# Altium project Adafruit nRF52840 Bluefruit Feather Express Rev D.PrjPcb
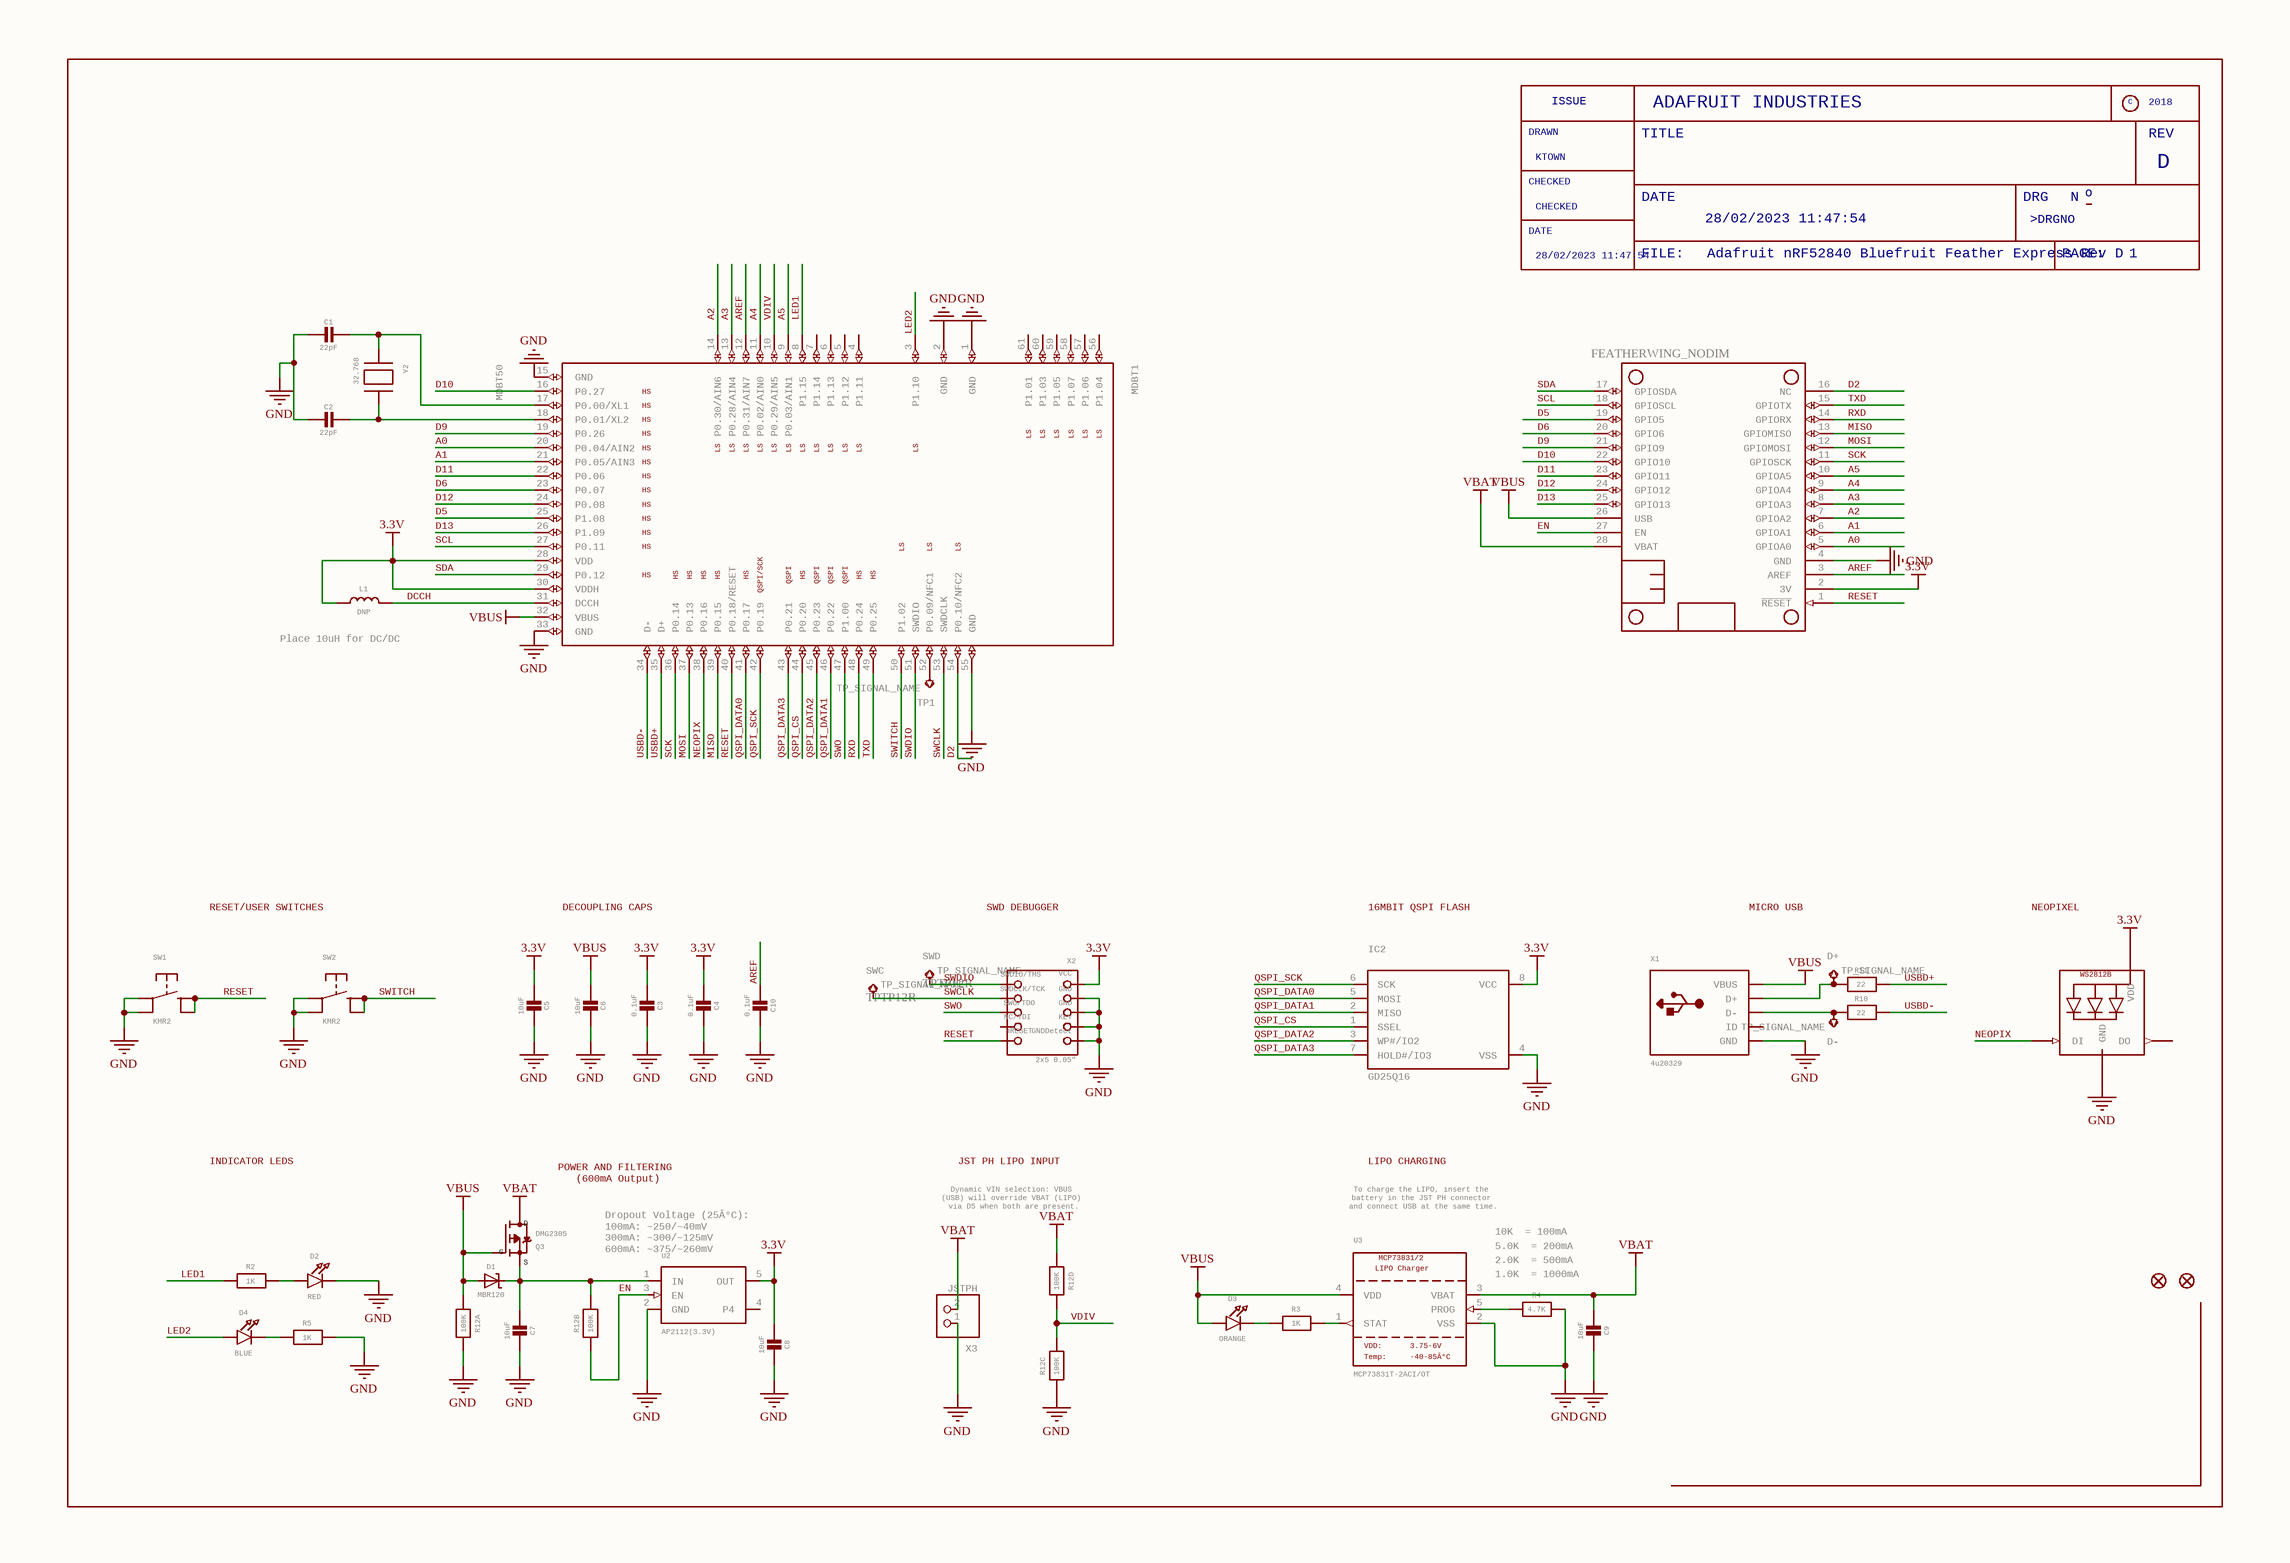
[diagram p0: Adafruit nRF52840 Bluefruit Feather Express Rev D_1.SchDoc]
1 sheet, 42 parts. Net scope: global (net labels, ports and power ports of the same name join across sheets).
Board file: Adafruit nRF52840 Bluefruit Feather Express Rev D.PcbDoc

## Sheet Adafruit nRF52840 Bluefruit Feather Express Rev D_1.SchDoc: Adafruit nRF52840 Bluefruit Feather Express Rev D
size 409 x 279 mm; Origin: Eagle; SheetNumber: 1; YEAR: 2018; COMPANY: ADAFRUIT INDUSTRIES; DRAWN: KTOWN; Date: 28/02/2023 11:47:54; REV: D; GateName_1: G$1; SymbolName_1: FRAME_A3; LibraryName: microbuilder; DeviceSetName: FRAME_A3; GateName_2: G$3; SymbolName_2: FRAME_DOCFIELD; DRG: DRG; o: o; N: N; C: C; ISSUE: ISSUE; FILE: FILE:; PAGE: PAGE:; CHECKED: CHECKED; DRGNO: >DRGNO

### Parts
C1  22pF  [0603-NO]
C2  22pF  [0603-NO]
C3  0.1uF  [0603-NO]
C4  0.1uF  [0603-NO]
C5  10uF  [0805-NO]
C6  10uF  [0805-NO]
C7  10uF  [0805-NO]
C8  10uF  [0805-NO]
C9  10uF  [0805-NO]
C10  0.1uF  [0603-NO]
D1  MBR120  [SOD-123]
D2  RED  [CHIPLED_0805_NOOUTLINE]
D3  ORANGE  [CHIPLED_0805_NOOUTLINE]
D4  BLUE  [CHIPLED_0805_NOOUTLINE]
D+  TPTP10R  [TP10R]  (value not drawn)
D-  TPTP10R  [TP10R]  (value not drawn)
FID1  FIDUCIAL_1MM  [FIDUCIAL_1MM]  (value not drawn)
FID2  FIDUCIAL_1MM  [FIDUCIAL_1MM]  (value not drawn)
IC2  GD25Q16  [USON8]
L1  DNP  [_0805MP]
LED1  WS2812B3535  [LED3535]  (value not drawn)
MDBT1  MDBT50  [MDBT50]
MS1  FEATHERWING_NODIM  [FEATHERWING_NODIM]
Q3  DMG2305  [SOT23-R]
R2  1K  [0603-NO]
R3  1K  [0603-NO]
R4  4.7K  [0603-NO]
R5  1K  [0603-NO]
R10  22  [0603-NO]
R11  22  [0603-NO]
R12  100K  [RESPACK_4X0603]  (parts A,B,C,D of 4)
SW1  KMR2  [BTN_KMR2_4.6X2.8]
SW2  KMR2  [BTN_KMR2_4.6X2.8]
SWC  TPTP12R  [TP12R]
SWD  TPTP12R  [TP12R]
TP1  TPTP10R  [TP10R]  (value not drawn)
U2  AP2112(3.3V)  [SOT23-5]
U3  MCP73831T-2ACI/OT  LIPOCharger: LIPO Charger  Temp: Temp:  VDD: VDD:  [SOT23-5]
X1  4u20329  [4UCONN_20329_V2]
X2  2x5 0.05"  [2X05_1.27MM_BOX_POSTS]
X3  JSTPH  [JSTPH2]
Y2  32.768  [XTAL3215]

### Nets
3.3V: C3.2 C4.2 C5.2 C8.2 IC2.8(VCC) L1.1 LED1.2(VDD) MDBT1.28(VDD) MDBT1.30(VDDH) MS1.2(3V) U2.5(OUT) X2.1(VCC)
GND: C1.2 C2.2 C3.1 C4.1 C5.1 C6.1 C7.1 C8.1 C9.1 C10.1 D2.C IC2.4(VSS) LED1.4(GND) MDBT1.1(GND) MDBT1.2(GND) MDBT1.15(GND) MDBT1.33(GND) MDBT1.55(GND) MS1.4(GND) R4.2 R5.2 R12.3 R12.8 SW1.A(P) SW1.A'(P1) SW2.A(P) SW2.A'(P1) U2.2(GND) U3.2(VSS) X1.BASE@1,BASE@2,GND,SPRT@1,SPRT@2,SPRT@3,SPRT@4(GND) X2.3(GND) X2.5(GND) X2.7(KEY) X2.9(GNDDETECT) X3.1
VBAT: C9.2 MS1.28(VBAT) Q3.3(D) R12.4 U3.3(VBAT) X3.2
VBUS: C6.2 D1.A D3.A MDBT1.32(VBUS) MS1.26(USB) Q3.1(G) R12.1 U3.4(VDD) X1.VBUS
A0: MDBT1.20(P0.04/AIN2) MS1.5(GPIOA0)
A1: MDBT1.21(P0.05/AIN3) MS1.6(GPIOA1)
A2: MDBT1.14(P0.30/AIN6) MS1.7(GPIOA2)
A3: MDBT1.13(P0.28/AIN4) MS1.8(GPIOA3)
A4: MDBT1.11(P0.02/AIN0) MS1.9(GPIOA4)
A5: MDBT1.9(P0.03/AIN1) MS1.10(GPIOA5)
AREF: C10.2 MDBT1.12(P0.31/AIN7) MS1.3(AREF)
D2: MDBT1.54(P0.10/NFC2) MS1.16(NC)
D5: MDBT1.25(P1.08) MS1.19(GPIO5)
D6: MDBT1.23(P0.07) MS1.20(GPIO6)
D9: MDBT1.19(P0.26) MS1.21(GPIO9)
D10: MDBT1.16(P0.27) MS1.22(GPIO10)
D11: MDBT1.22(P0.06) MS1.23(GPIO11)
D12: MDBT1.24(P0.08) MS1.24(GPIO12)
D13: MDBT1.26(P1.09) MS1.25(GPIO13)
DCCH: L1.2 MDBT1.31(DCCH)
EN: MS1.27(EN) R12.2 U2.3(EN)
LED1: MDBT1.8(P1.15) R2.1
LED2: D4.A MDBT1.3(P1.10)
MISO: MDBT1.39(P0.15) MS1.13(GPIOMISO)
MOSI: MDBT1.37(P0.13) MS1.12(GPIOMOSI)
NEOPIX: LED1.1(DI) MDBT1.38(P0.16)
QSPI_CS: IC2.1(SSEL) MDBT1.44(P0.20)
QSPI_DATA0: IC2.5(MOSI) MDBT1.41(P0.17)
QSPI_DATA1: IC2.2(MISO) MDBT1.46(P0.22)
QSPI_DATA2: IC2.3(WP#/IO2) MDBT1.45(P0.23)
QSPI_DATA3: IC2.7(HOLD#/IO3) MDBT1.43(P0.21)
QSPI_SCK: IC2.6(SCK) MDBT1.42(P0.19)
RESET: MDBT1.40(P0.18/RESET) MS1.1(~{RESET}) SW1.B(S) SW1.B'(S1) X2.10(NRESET)
RXD: MDBT1.48(P0.24) MS1.14(GPIORX)
SCK: MDBT1.36(P0.14) MS1.11(GPIOSCK)
SCL: MDBT1.27(P0.11) MS1.18(GPIOSCL)
SDA: MDBT1.29(P0.12) MS1.17(GPIOSDA)
SWCLK: MDBT1.53(SWDCLK) SWC.TP X2.4(SWDCLK)
SWDIO: MDBT1.51(SWDIO) SWD.TP X2.2(SWDIO)
SWITCH: MDBT1.50(P1.02) SW2.B(S) SW2.B'(S1)
SWO: MDBT1.47(P1.00) X2.6(SWO)
TXD: MDBT1.49(P0.25) MS1.15(GPIOTX)
USBD+: MDBT1.35(D+) R11.2
USBD-: MDBT1.34(D-) R10.2
VDIV: MDBT1.10(P0.29/AIN5) R12.5 R12.6
NetC1_1: C1.1 MDBT1.17(P0.00/XL1) Y2.P$1
NetC2_1: C2.1 MDBT1.18(P0.01/XL2) Y2.P$2
NetC7_2: C7.2 D1.C Q3.2(S) R12.7 U2.1(IN)
NetD2_A: D2.A R2.2
NetD3_C: D3.C R3.1
NetD4_C: D4.C R5.1
NetD+_TP: D+.TP R11.1 X1.D+
NetD-_TP: D-.TP R10.1 X1.D-
NetMDBT1_52: MDBT1.52(P0.09/NFC1) TP1.TP
NetR3_2: R3.2 U3.1(STAT)
NetR4_1: R4.1 U3.5(PROG)

Not connected (* = marked no-connect by the designer): LED1 3(DO); MDBT1 4(P1.11) 5(P1.12) 6(P1.13) 7(P1.14) 56(P1.04) 57(P1.06) 58(P1.07) 59(P1.05) 60(P1.03) 61(P1.01); U2 4(P4); X1 ID; X2 8(TDI)

### Notes on the sheet
- ISSUE
- C
- 2018
- DRAWN
- KTOWN
- TITLE
- ADAFRUIT INDUSTRIES
- REV
- D
- CHECKED
- DATE
- 28/02/2023 11:47:54
- DRG
- >DRGNO
- N
- o
- FILE:
- Adafruit nRF52840 Bluefruit Feather Express Rev D
- PAGE:
- 1
- (near L1) Place 10uH for DC/DC
- RESET/USER SWITCHES
- DECOUPLING CAPS
- SWD DEBUGGER
- 16MBIT QSPI FLASH
- MICRO USB
- NEOPIXEL
- INDICATOR LEDS
- JST PH LIPO INPUT
- LIPO CHARGING
- (near Q3) POWER AND FILTERING
  (600mA Output)
- Dynamic VIN selection: VBUS
  (USB) will override VBAT (LIPO)
  via D5 when both are present.
- To charge the LIPO, insert the
  battery in the JST PH connector
  and connect USB at the same time.
- 10K  = 100mA
- (near U2) Dropout Voltage (25Â°C):
  100mA: ~250/~40mV
  300mA: ~300/~125mV
  600mA: ~375/~260mV
- 5.0K  = 200mA
- 2.0K  = 500mA
- 1.0K  = 1000mA

### Library data of the parts
C1-C4 C10 = CAP_CERAMIC0603_NO: Ceramic Capacitors   For new designs, use the packages preceded by an '_' character since they are more reliable:   The following footprints should be used on most boards: _0402 - Standard footprint for regular board layouts  _0603 - Standard footprint for regular board layouts  _0805 - Standard footprint for regular board layouts  _1206 - Standard footprint for regular board layouts       For extremely tight-pitch boards where space is at a premium, the following 'micro-pitch' footprints can be used (smaller pads, no silkscreen outline, etc.): _0402MP - Micro-pitch footprint for very dense/compact boards  _0603MP - Micro-pitch footprint for very dense/compact boards  _0805MP - Micro-pitch footprint for very dense/compact boards  _1206MP - Micro-pitch footprint for very dense/compact boards; GateName_1: G$1; SymbolName_1: CAPACITOR; DeviceName: 0603_NO; LibraryName: microbuilder; DeviceSetName: CAP_CERAMIC
C5-C9 = CAP_CERAMIC0805-NOOUTLINE: Ceramic Capacitors   For new designs, use the packages preceded by an '_' character since they are more reliable:   The following footprints should be used on most boards: _0402 - Standard footprint for regular board layouts  _0603 - Standard footprint for regular board layouts  _0805 - Standard footprint for regular board layouts  _1206 - Standard footprint for regular board layouts       For extremely tight-pitch boards where space is at a premium, the following 'micro-pitch' footprints can be used (smaller pads, no silkscreen outline, etc.): _0402MP - Micro-pitch footprint for very dense/compact boards  _0603MP - Micro-pitch footprint for very dense/compact boards  _0805MP - Micro-pitch footprint for very dense/compact boards  _1206MP - Micro-pitch footprint for very dense/compact boards; GateName_1: G$1; SymbolName_1: CAPACITOR; DeviceName: 0805-NOOUTLINE; LibraryName: microbuilder; DeviceSetName: CAP_CERAMIC
D1 = DIODE-SCHOTTKYSOD-123: GateName_1: G$1; SymbolName_1: DIODE-SCHOTTKY; DeviceName: SOD-123; LibraryName: microbuilder; DeviceSetName: DIODE-SCHOTTKY
D2-D4 = LED0805_NOOUTLINE: LED0603 - 0603 Surface Mount Package    2mA: Green LED - Low Power (3.9mcd, 2ma, 1.7Vf) - Digikey: 475-2709-2-ND  Orange LED - Low Power (9.8mcd, 2ma, 1.8Vf) - Digikey: 475-1194-2-ND  Red LED - Low Power (5mcd, 2ma, 1.8Vf) - Digikey: 475-1195-2-ND  Yellow LED - Low Power (7mcd, 2ma, 1.8Vf) - Digikey: 475-1196-2-ND       5mA: Blue LED - Low Power (17mcd, 5ma, 2.9Vf) - Digikey: LNJ937W8CRACT-ND    0805 - 0805 Surface Mount Package    2mA: Red LED (8.8mcd, 2mA, 1.8Vf, Clear) - Low Power [Digikey: 475-2510-1-ND]  Green LED (5mcd, 2mA, 1.8Vf, Clear) - Low Power [Digikey: 475-2730-1-ND]  Yellow LED (11.3mcd, 2mA, 1.8Vf, Clear) - Low Power [Digikey: 475-2555-1-ND]       20mA: Red LED (104mcd, 20mA, Diffused) - LS R976 [Digikey: 475-1278-6-ND]  Red LED (12mcd, 20mA, 2.0Vf, Clear) - APT2012EC [Digikey: 754-1128-1-ND]  Green LED (15mcd, 20mA, 2.2Vf, Clear) - APT2012GC [Digikey: 754-1131-1-ND]  Orange LED (160mcd, 20mA, 2.1Vf, Clear) - APT2012SECK [Digikey: 754-1130-1-ND]     1206 - 1206 Surface Mount Package  Green LED (26mcd, 20mA, Diffused) - LG N971  [Digikey: 475-1407-6-ND]  Red LED (15mcd, 20mA, Diffused) - LH N974 [Digikey: 475-1416-6-ND]     Cree - Cree High-Power Surface Mount LEDs  XPEBWT-L1-0000-00D50 - White 111lm 350mA 2.9Vf 6200K 110Â°  XTEAWT-00-0000-00000LEE3 - White 114lm 350mA 2.85Vf 5000K 115Â°     Everlight - Everlight 45-21 Series Surface Mount LEDs  45-21/QK2C-B2832AC2CB2/2T - Warm White 2000mcd 20mA 3.25Vf 3050K 120Â°  45-21/LK2C-B38452C4CB2/2T - Nuetral White 2000mcd 20mA 3.25Vf 4150K 120Â°  45-21/LK2C-B50634C6CB2/2T - Cold White 2200mcd 20mA 3.25Vf 5650K 120Â°     PLCC2 Reverse Mount LS T77K-J1L2-1-0-2-R18-Z - Red 11.25mcd 2mA 1.8Vf 630nm 120Â°  LO T77K-L1M2-24-Z - Orange 19.6mcd 2mA 1.8Vf 606nm 120Â°  LY T77K-K2M1-26-Z - Yellow 15.7mcd 2mA 1.8Vf 587nm 120Â°; GateName_1: G$1; SymbolName_1: LED; DeviceName: 0805_NOOUTLINE; LibraryName: microbuilder; DeviceSetName: LED
D+ D- TP1 = TPTP10R: Test pad; GateName_1: G$1; SymbolName_1: TP; DeviceName: TP10R; LibraryName: testpad; DeviceSetName: TP; TP_SIGNAL_NAME: TP_SIGNAL_NAME
FID1 FID2 = FIDUCIAL_1MM: Fiducial Alignment Points   Various fiducial points for machine vision alignment.; GateName_1: G$1; DeviceName: _1MM; BOM: EXCLUDE; SymbolName_1: FIDUCIAL; LibraryName: microbuilder; DeviceSetName: FIDUCIAL
IC2 = SPIFLASH_8PINUX: SOIC8 SPI Flash   Be careful with the size since SOIC8 flash comes in several 'widths'   SOIC8 150 mil M25P16 - 16Mbit (2Mbit x 8) Serial Flash (75MHz SPI Bus), Supply: 2.7-3.6V  Digikey:  SOIC8 - M25P16-VMN6P-ND       SOIC8 208 mil W25Q16BVSSIG - 16Mbit (2Mbit x 8) Serial Flash (104MHz SPI Bus), Supply: 2.7-3.6V  Digikey:  SOIC8 - W25Q16BVSSIG-ND; GateName_1: G$1; DeviceName: UX; SymbolName_1: M25P16; LibraryName: microbuilder; DeviceSetName: SPIFLASH_8PIN
L1 = INDUCTOR_0805MP: Inductors   0603: 10nH Ceramic Inductor - microwire antenna/RF (Digikey: 712-1434-2-ND)       0805: 560nH Ceramic Inductor - RF (Digikey: 553-1047-1-ND)  270nH Ceramic Inductor - Q = 40@250MHz, +-5%, 1 Ohm DC Resistance (Digikey: 535-10506-2-ND)       1007 (2518 Metric) SMT: 10ÂµH 10% 250mOhm 820mA 1007 Inductor (Digikey: 587-2189-1-ND)  22ÂµH 10% 500mOhm 580mA 1007 Inductor (Digikey: 587-2190-1-ND)  47ÂµH 10% 950mOhm 420mA 1007 Inductor (Digikey: 587-2191-1-ND)  47ÂµH 5% 100mOhm 1A 1008 Inductor (Digikey: 732-1816-1-ND)       5.0x5.0mm (Taiyo Yuden NR5040 Series) 6.8ÂµH 20% 2.3A 64mOhm Inductor (Digikey: 587-2374-2-ND)       5.0x5.0mm (TDK VLC5045 Series) 4.7ÂµH 20% 3.3A 34mOhm Inductor (Digikey: 445-6526-1-ND)  6.8ÂµH 20% 2.7A 46mOhm Inductor (Digikey: 445-6527-1-ND)       6.0x6.0mm (TDK VLC6045 Series) 4.7ÂµH 20% 3.8A 27mOhm Inductor (Digikey: 445-6538-2-ND)  6.8ÂµH 20% 3A 41mOhm Inductor (Digikey: 445-6540-1-ND)  6.2ÂµH 30% 2.2A 45mOhm Inductor (Digikey: SRR5028-6R2YCT-ND) - Not TDK VLC6045 but footprint should match       6.0x6.0mm (TDK SLF6045 Series) 6.8uH 30% 2A 33mOhm Inductor (Digikey: 445-4572-1-ND, Mouser: 810-SLF645T6R8N2R0PF)       6.0x6.0mm (Sumida CDRH5D28 Series) 6.2uH 30% 1.8A 45mOhm Inductor (Digikey: 308-1542-1-ND)       Taiyo Yuden NR3015T2R2M - 2.2uH 20% 1.5A (Digikey: 587-1648-2-ND, Mouser: 963-NR3015T2R2M) - Used with TI TPS62172   CoilCraft RFID Transponder Coil - MA5532-AE (For use with AS3935 Lightning Sensor)   Taiyo Yuden NRH2412T2R2MNGH - 2.2uH 20% 1AA (Digikey: 587-3443-1-ND) - Used with TI LM3671   Vishay IHLP  1.0uH Molded Inductor - 24mOhm DCR, 5A, +/-20%, -55Â°C-125Â°C (Digikey: 541-1319-1-ND); GateName_1: G$1; SymbolName_1: INDUCTOR; DeviceName: _0805MP; LibraryName: microbuilder; DeviceSetName: INDUCTOR
LED1 = WS2812B3535: GateName_1: G$1; SymbolName_1: WS2812BLED; DeviceName: 3535; LibraryName: microbuilder; DeviceSetName: WS2812B; WS2812B: WS2812B
MDBT1 = MDBT50: Raytac Corporation   MDBT50  Bluetooth Low Energy Module based on Noridc nRF52840    Source:  Raytac datasheet; GateName_1: G$1; SymbolName_1: MDBT50; LibraryName: microbuilder; DeviceSetName: MDBT50; LS: LS; HS: HS; QSPI: QSPI; QSPI/SCK: QSPI/SCK
MS1 = FEATHERWING_NODIM: GateName_1: G$1; SymbolName_1: MICROSHIELD; DeviceName: _NODIM; LibraryName: microbuilder; DeviceSetName: FEATHERWING
Q3 = MOSFET-P: P-Channel Mosfet   LEGEND   VDS: Voltage Drain-Source ID: Drain Current RDS(ON): Drain-Source On-State Resistance VGS(TH): Gate-Source Threshold Voltage CISS: Drain-Source Input Capacitance    SOT-23   Name	VDS	ID	RDS(ON)	VGS(TH)	CISS	Order Number	   IRLML5103	30V	760mA	600 mOhm	--	75pF @ 25V	Digikey: IRLML5103PBFCT-ND	   IRLML6401	12V	4.3A	50 mOhm	950mV @ 250ÂµA	830pF @ 10V	Digikey: IRLML6401PBFTR-ND	   NTR0202PL	20V	400mA	800 mOhm	2.3V @ 250uA	70pF @ 5V	Digikey: NTR0202PLT1GOSTR-ND	   NTR4101PT1G	20V	1.8A	85 mOhm	1.2V @ 250uA	675pF @ 10V	Digikey: NTR4101PT1GOSCT-ND	   DMP2004K	20V	600mA	900 mOhm	1V @ 250uA	175pF @ 16V	Digikey: DMP2004KDICT-ND	   PMV65XP	20V	3.9A	76 mOhm	950mV @ 1mA	725pF @ 20V	Digikey: 568-2358-2-ND	   							   							TO-252   Name	VDS	ID	RDS(ON)	VGS(TH)	CISS	Order Number	   AOD417	30V	25A	34 mOhm	3V @ 250ÂµA	920pF @ 15V	Digikey: 785-1106-2-ND	PowerPak   Name	VDS	ID	RDS(ON)	VGS(TH)	CISS	Order Number	   AON7401	30V	12A	14 mOhm	3V @ 250ÂµA	2600pF @ 15V	Digikey: 785-1302-1-ND; GateName_1: G$1; SymbolName_1: MOSFET-P; LibraryName: microbuilder; DeviceSetName: MOSFET-P; D: D; S: S; G: G
R2-R5 R10 R11 = RESISTOR_0603_NOOUT: Resistors   For new designs, use the packages preceded by an '_' character since they are more reliable:   The following footprints should be used on most boards: _0402 - Standard footprint for regular board layouts  _0603 - Standard footprint for regular board layouts  _0805 - Standard footprint for regular board layouts  _1206 - Standard footprint for regular board layouts       For extremely tight-pitch boards where space is at a premium, the following 'micro-pitch' footprints can be used (smaller pads, no silkscreen outline, etc.): _0402MP - Micro-pitch footprint for very dense/compact boards  _0603MP - Micro-pitch footprint for very dense/compact boards  _0805MP - Micro-pitch footprint for very dense/compact boards  _1206MP - Micro-pitch footprint for very dense/compact boards; GateName_1: G$1; SymbolName_1: RESISTOR; DeviceName: _0603_NOOUT; LibraryName: microbuilder; DeviceSetName: RESISTOR
R12 = RESISTOR_4PACK: Resistor Packs (4 resistors)   4 x 0603 10K 1/16W - Digikey: YC164J-10KCT-ND; GateName_1: G$1; GateName_2: G$2; GateName_3: G$3; GateName_4: G$4; SymbolName_1: RESISTOR; SymbolName_2: RESISTOR; SymbolName_3: RESISTOR; SymbolName_4: RESISTOR; LibraryName: microbuilder; DeviceSetName: RESISTOR_4PACK
SW1 SW2 = SWITCH_TACT_SMT4.6X2.8: SMT Tact Switches 6x6mm - Digikey: P12940SCT-ND  KMR2 (4.6x2.8mm) - Digikey: 401-1426-1-ND  EVQ-PQHB55 - Light Touch, 160GF (4.5x4.5mm) - Digikey: P8090SCT-ND  KMT0 - KMT021 NGJ LHS (etc.) IP68/Waterproof - Digikey: CKN10289CT-ND; GateName_1: G$1; SymbolName_1: BUTTON_4PIN; DeviceName: 4.6X2.8; LibraryName: microbuilder; DeviceSetName: SWITCH_TACT_SMT
SWC SWD = TPTP12R: Test pad; GateName_1: G$1; SymbolName_1: TP; DeviceName: TP12R; LibraryName: testpad; DeviceSetName: TP; TP_SIGNAL_NAME: TP_SIGNAL_NAME
U2 = VREG_SOT23-5: SOT23-5 Fixed Voltage Regulators      Part	Current Out	V Out	V In	V Dropout	Î¸JA (Â°C/W)	TJ (Â°C)	Digikey Part No.	     ADP121	  150mA	  3.3V	  3.4-5.5V	  0.09V @ 150mA	  --	  --	  ADP121-AUJZ33R7CT-ND	     ADP121	  150mA	  3.0V	  3.1-5.5V	  0.09V @ 150mA	  --	  --	  ADP121-AUJZ30R7CT-ND	     ADP122	  300mA	  3.3V	  3.4-5.5V	  0.085V @ 300mA	  --	  --	  ADP122AUJZ-3.3-R7CT-ND	     ADP1712	  300mA	  3.3V	  3.5-5.5V	  0.17V @ 300mA	  --	  --	  ADP1712AUJZ-3.3-R7TR-ND	     AP7311 (Low Cost)	  150mA	  3.3V	  3.5-6V	  0.15V @ 150mA	  --	  --	  AP7311-33WG-7DICT-ND	     LD39015M18R	  150mA	  1.8V	  1.9V-5.5V	  0.08V @ 100mA	  --	  --	  497-6977-1-ND	     LP2985A-33DBVR	  150mA	  3.3V	  3.3-16V	  0.28V @ 150mA	  206	  150	  296-18479-1-ND	     MCP1824T-3302E/OT	  300mA	  3.3V	  3.5V-6V	  0.2V @ 300mA	  --	  --	  MCP1824T-3302E/OTCT-ND	     MIC5205-2.5YM5 TR	  150mA	  2.5V	  2.7-16V	  0.165V @ 150mA	  --	  --	  576-1257-2-ND	     MIC5205-3.0YM5 TR	  150mA	  3.0V	  3.2V-16V	  0.165V @ 150mA	  --	  --	  576-1258-2-ND	     MIC5205-3.3YM5 TR	  150mA	  3.3V	  3.5V-16V	  0.165V @ 150mA	  --	  --	  576-1259-2-ND	     TPS780330220	  150mA	  3.3V+2.2V	  3.6-5.5V	  250mV Max	  --	  --	  296-23332-1-ND	     TDA3663/N1,135	  100mA	  3.3V	  3.5-45V	  0.18V @ 50mA	  --	  --	  568-5343-1-ND	     	  	  	  	  	  	  	  	     	  	  	  	  	  	  	  	   Max operating temp can be calculated using Î¸JA, TJ (max junction temperature), and power in watts.  Set the "Maximum Ambient Temperature" until it reaches TJ ("Max Junction Temperature"), which is the absolute limit for safe use of the regulator: Heat Sink Temperature Calculator   For example, With 12V source into a 3.3V LP2985 and a 30mA load, we are dissipating (12V-3.3V) * 0.03A = 0.261W.  With a Î¸JA of 206 Â°C/W, a TJ of 150Â°C, and 261mW we can safely use the chip without a heat sink up to 75Â°C (=147.1Â°C Junction Temperature).; GateName_1: G$1; SymbolName_1: VREG_SOT23-5; LibraryName: microbuilder; DeviceSetName: VREG_SOT23-5
U3 = MCP73831/2: MCP73831/2 LIPO Charger    VDD: 3.75 - 6V  Temp -40 - 85Â°C  Programmable Charge Rate: 15-500mA       NOTE: STAT is a tri-state logic output on the MCP73831 and an open-drain output on the MCP73832.   SOT23-5 with 4.2V output and tri-state logic on STAT = MCP73831T-2ACI/OT; GateName_1: G$1; SymbolName_1: MCP73831/2; LibraryName: microbuilder; DeviceSetName: MCP73831/2; MCP73831/2: MCP73831/2; -40-85Â°C: -40-85Â°C; 3.75-6V: 3.75-6V
X1 = USB_MICRO_20329_V2: USB ConnectorsUSBMINIB - Surface Mount Female Mini-B USB Connector    4UConnector: 06564; GateName_1: G$1; SymbolName_1: USB; DeviceName: _MICRO_20329_V2; LibraryName: microbuilder; DeviceSetName: USB
X2 = JTAG-CORTEXBOXPOSTS: Serial Wire (SW-DP) Connector   Standard 0.05" 10-pin connector is for use with the Cortex M and Cortex A SWD (serial wire debugger) interface (SW-DP)Connectors 2x05_1.27MM_SMT - Inexpensive surface-mount header with bare pins, compatible with standard 10-pin SWD cables (4UCON: 16846)  2x05_1.27MM_BOX_NOPOSTS - Polarised surface-mount box (4UCON with caps: 19735, without caps: 15117  2x05_1.27MM_BOX_POSTS - Polarised surface-mount box with mounting holes (4UCON: 20317)    Pinout: http://infocenter.arm.com/help/topic/com.arm.doc.faqs/attached/13634/cortex_debug_connectors.pdf  http://www.keil.com/peripherals/coresight/connectors.asp; GateName_1: G$1; SymbolName_1: JTAG-CORTEX; DeviceName: BOXPOSTS; LibraryName: microbuilder; DeviceSetName: JTAG-CORTEX; nRESET: nRESET; NC/TDI: NC/TDI; SWO/TDO: SWO/TDO; SWDCLK/TCK: SWDCLK/TCK; SWDIO/TMS: SWDIO/TMS; VCC: VCC; GND: GND; KEY: KEY; GNDDetect: GNDDetect
X3 = CON_JST_PH_2PIN: JST 2-Pin Right-Angle Connector  PH-Series - 4UConnector: 17311  SH-Series - 4UConnector: 07278; GateName_1: G$1; SymbolName_1: PINHD2; LibraryName: microbuilder; DeviceSetName: CON_JST_PH_2PIN
Y2 = XTAL-3.2X1.5: Low cost SMT crystals, no capacitors included    http://www.ladyada.net/library/eagle; GateName_1: G$1; SymbolName_1: XTAL; DeviceName: -3.2X1.5; LibraryName: adafruit2; DeviceSetName: XTAL